# EAGLE design buffer (EAGLE 6.4)

## Sheet 1 of 5
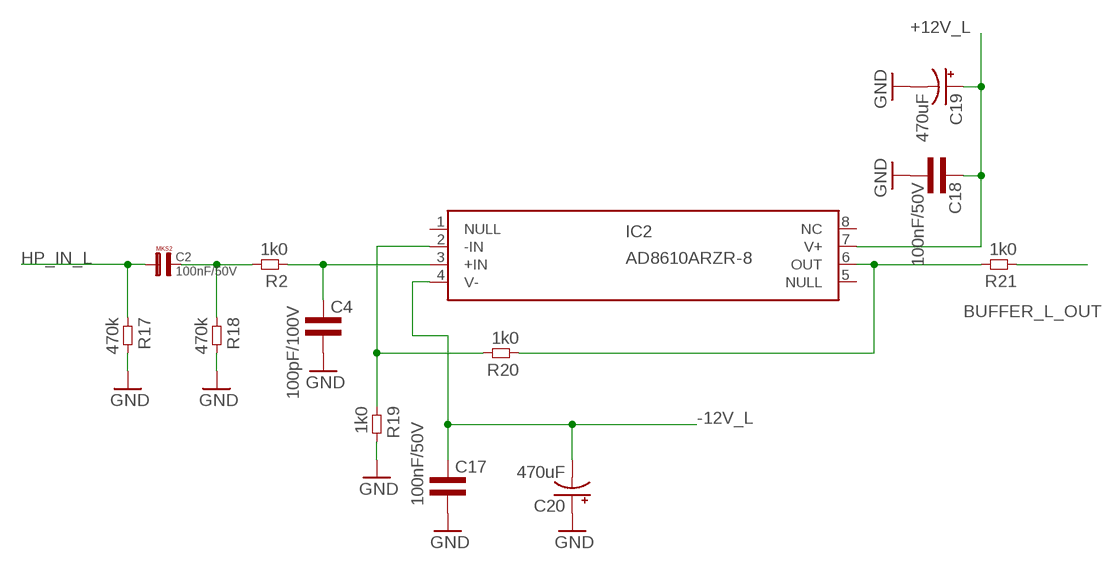
[diagram p0: schematic, sheet 1]

### Parts
C2  100nF/50V  0,1µF  [R5B3]
C4  100pF/100V  CAP0603L3  [0603L3]
C17  100nF/50V  CAP0603L3  [0603L3]
C18  100nF/50V  CAP0603L3  [0603L3]
C19  470uF  CPOL-USE3.5-8  [E3,5-8]
C20  470uF  CPOL-USE3.5-8  [E3,5-8]
IC2  AD8610ARZR-8  [8-LEAD-SOIC_N]
R2  1k0  RES0603L3  [0603L3]
R17  470k  RES0603L3  [0603L3]
R18  470k  RES0603L3  [0603L3]
R19  1k0  RES0603L3  [0603L3]
R20  1k0  RES0603L3  [0603L3]
R21  1k0  RES0603L3  [0603L3]

### Nets
+12V_L: C18.P$1 C19.+ IC2.7(V+) ; also sheet 2
-12V_L: C17.P$1 C20.- IC2.4(V-) ; also sheet 2
BUFF_L_OUT: R21.P$1 ; also sheet 2
BUFFER_L_OUT: IC2.6(OUT) R20.P$1 R21.P$2
GND: C4.P$2 C17.P$2 C18.P$2 C19.- C20.+ R17.P$2 R18.P$2 R19.P$2 ; also sheet 2,3,4,5
HP_IN_L: C2.1 R17.P$1 ; also sheet 5
N$6: C2.2 R2.P$2 R18.P$1
N$7: C4.P$1 IC2.3(+IN) R2.P$1
N$12: IC2.2(-IN) R19.P$1 R20.P$2
Unconnected: IC2.1(NULL) IC2.5(NULL) IC2.8(NC)

## Sheet 2 of 5
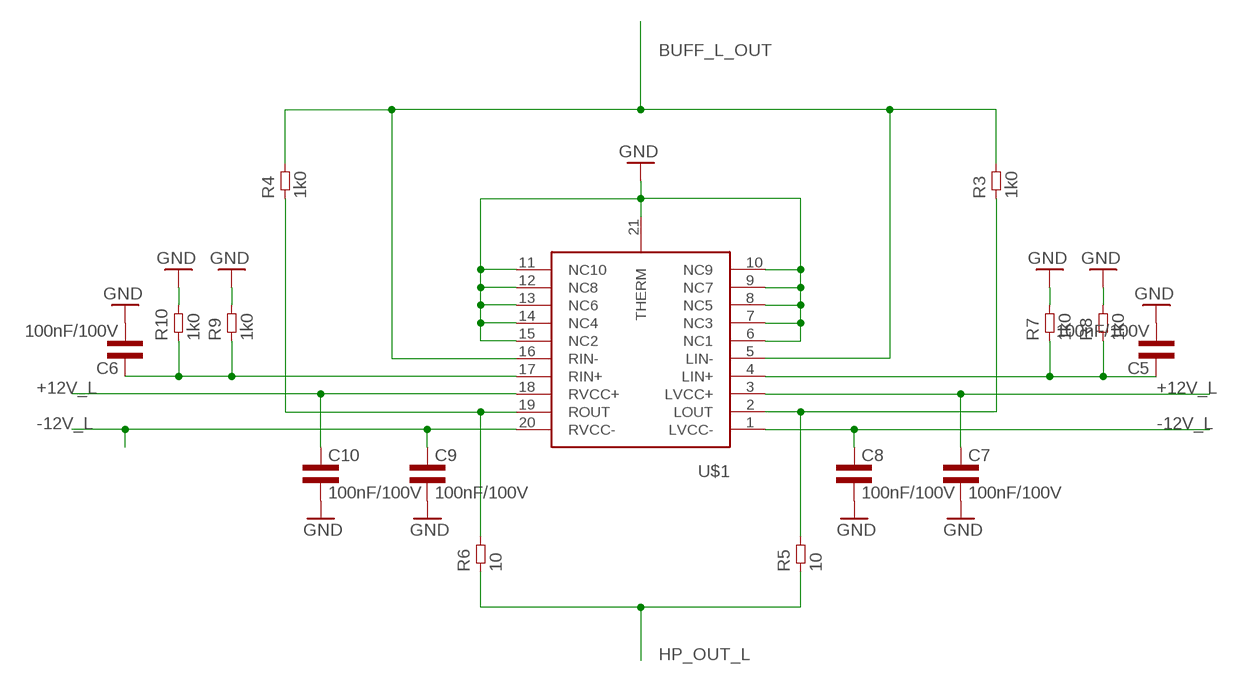
[diagram p1: schematic, sheet 2]

### Parts
C5  100nF/100V  CAP0603L3  [0603L3]
C6  100nF/100V  CAP0603L3  [0603L3]
C7  100nF/100V  CAP0805L3  [0805L3]
C8  100nF/100V  CAP0805L3  [0805L3]
C9  100nF/100V  CAP0805L3  [0805L3]
C10  100nF/100V  CAP0805L3  [0805L3]
R3  1k0  RES0603L3  [0603L3]
R4  1k0  RES0603L3  [0603L3]
R5  10  RES1210L3  [1210L3]
R6  10  RES1210L3  [1210L3]
R7  1k0  RES0603L3  [0603L3]
R8  1k0  RES0603L3  [0603L3]
R9  1k0  RES0603L3  [0603L3]
R10  1k0  RES0603L3  [0603L3]
U$1  TPA6120_TPA6120  [TPA6120_TPA6120]

### Nets
+12V_L: C7.1 C10.1 U$1.3(LVCC+) U$1.18(RVCC+) ; also sheet 1
-12V_L: C8.1 C9.1 U$1.1(LVCC-) U$1.20(RVCC-) ; also sheet 1
BUFF_L_OUT: R3.P$2 R4.P$2 U$1.5(LIN-) U$1.16(RIN-) ; also sheet 1
GND: C5.P$2 C6.P$2 C7.2 C8.2 C9.2 C10.2 R7.P$2 R8.P$2 R9.P$2 R10.P$2 U$1.6(NC1) U$1.7(NC3) U$1.8(NC5) U$1.9(NC7) U$1.10(NC9) U$1.11(NC10) U$1.12(NC8) U$1.13(NC6) U$1.14(NC4) U$1.15(NC2) U$1.21(THERM) ; also sheet 1,3,4,5
HP_OUT_L: R5.P$1 R6.P$1 ; also sheet 5
N$19: C5.P$1 R7.P$1 R8.P$1 U$1.4(LIN+)
N$20: C6.P$1 R9.P$1 R10.P$1 U$1.17(RIN+)
OUT_L: R3.P$1 R5.P$2 U$1.2(LOUT)
OUT_R: R4.P$1 R6.P$2 U$1.19(ROUT)

## Sheet 3 of 5
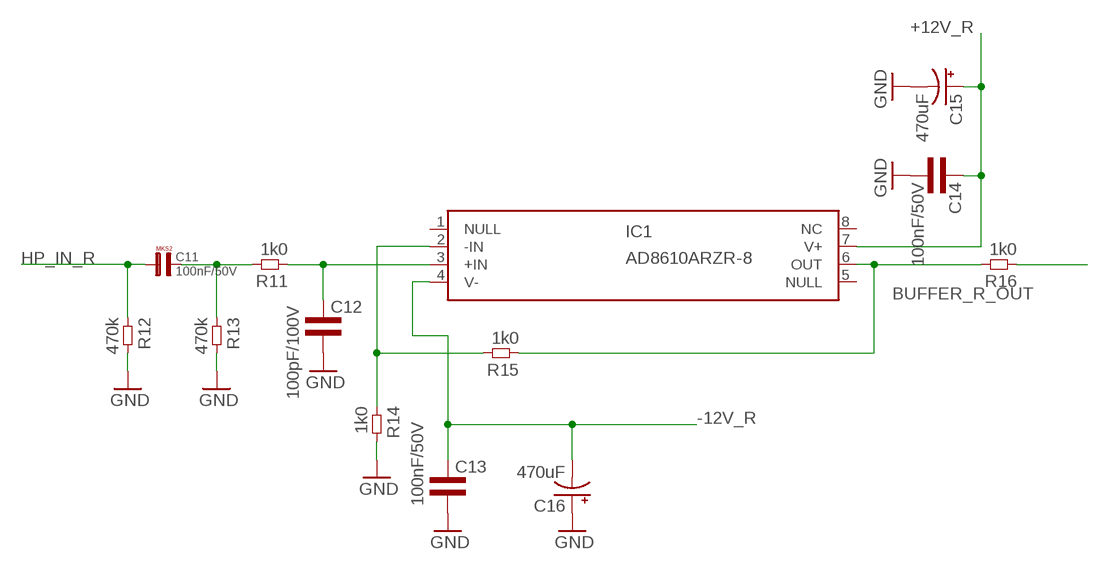
[diagram p2: schematic, sheet 3]

### Parts
C11  100nF/50V  0,1µF  [R5B3]
C12  100pF/100V  CAP0603L3  [0603L3]
C13  100nF/50V  CAP0603L3  [0603L3]
C14  100nF/50V  CAP0603L3  [0603L3]
C15  470uF  CPOL-USE3.5-8  [E3,5-8]
C16  470uF  CPOL-USE3.5-8  [E3,5-8]
IC1  AD8610ARZR-8  [8-LEAD-SOIC_N]
R11  1k0  RES0603L3  [0603L3]
R12  470k  RES0603L3  [0603L3]
R13  470k  RES0603L3  [0603L3]
R14  1k0  RES0603L3  [0603L3]
R15  1k0  RES0603L3  [0603L3]
R16  1k0  RES0603L3  [0603L3]

### Nets
+12V_R: C14.P$1 C15.+ IC1.7(V+) ; also sheet 4
-12V_R: C13.P$1 C16.- IC1.4(V-) ; also sheet 4
BUFF_R_OUT: R16.P$1 ; also sheet 4
BUFFER_R_OUT: IC1.6(OUT) R15.P$1 R16.P$2
GND: C12.P$2 C13.P$2 C14.P$2 C15.- C16.+ R12.P$2 R13.P$2 R14.P$2 ; also sheet 1,2,4,5
HP_IN_R: C11.1 R12.P$1 ; also sheet 5
N$1: C11.2 R11.P$2 R13.P$1
N$2: C12.P$1 IC1.3(+IN) R11.P$1
N$5: IC1.2(-IN) R14.P$1 R15.P$2
Unconnected: IC1.1(NULL) IC1.5(NULL) IC1.8(NC)

## Sheet 4 of 5
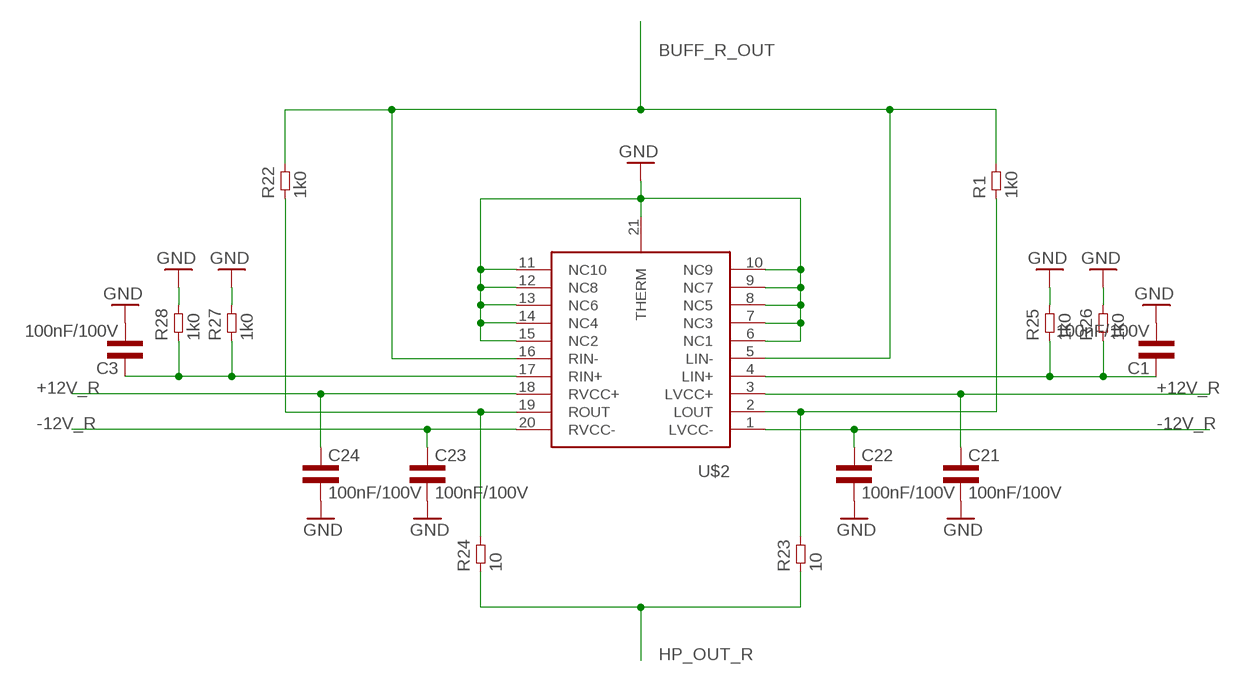
[diagram p3: schematic, sheet 4]

### Parts
C1  100nF/100V  CAP0603L3  [0603L3]
C3  100nF/100V  CAP0603L3  [0603L3]
C21  100nF/100V  CAP0805L3  [0805L3]
C22  100nF/100V  CAP0805L3  [0805L3]
C23  100nF/100V  CAP0805L3  [0805L3]
C24  100nF/100V  CAP0805L3  [0805L3]
R1  1k0  RES0603L3  [0603L3]
R22  1k0  RES0603L3  [0603L3]
R23  10  RES1210L3  [1210L3]
R24  10  RES1210L3  [1210L3]
R25  1k0  RES0603L3  [0603L3]
R26  1k0  RES0603L3  [0603L3]
R27  1k0  RES0603L3  [0603L3]
R28  1k0  RES0603L3  [0603L3]
U$2  TPA6120_TPA6120  [TPA6120_TPA6120]

### Nets
+12V_R: C21.1 C24.1 U$2.3(LVCC+) U$2.18(RVCC+) ; also sheet 3
-12V_R: C22.1 C23.1 U$2.1(LVCC-) U$2.20(RVCC-) ; also sheet 3
BUFF_R_OUT: R1.P$2 R22.P$2 U$2.5(LIN-) U$2.16(RIN-) ; also sheet 3
GND: C1.P$2 C3.P$2 C21.2 C22.2 C23.2 C24.2 R25.P$2 R26.P$2 R27.P$2 R28.P$2 U$2.6(NC1) U$2.7(NC3) U$2.8(NC5) U$2.9(NC7) U$2.10(NC9) U$2.11(NC10) U$2.12(NC8) U$2.13(NC6) U$2.14(NC4) U$2.15(NC2) U$2.21(THERM) ; also sheet 1,2,3,5
HP_OUT_R: R23.P$1 R24.P$1 ; also sheet 5
N$13: C1.P$1 R25.P$1 R26.P$1 U$2.4(LIN+)
N$14: C3.P$1 R27.P$1 R28.P$1 U$2.17(RIN+)
OUT_L1: R1.P$1 R23.P$2 U$2.2(LOUT)
OUT_R1: R22.P$1 R24.P$2 U$2.19(ROUT)

## Sheet 5 of 5
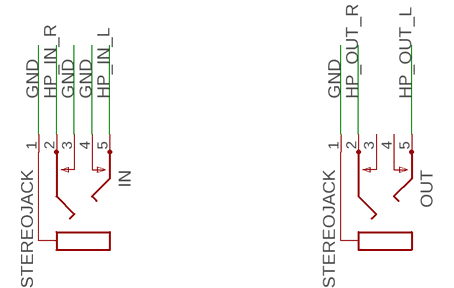
[diagram p4: schematic, sheet 5]

### Parts
IN  STEREOJACK  [STX3100]
OUT  STEREOJACK  [STX3100]

### Nets
GND: IN.1 IN.3 IN.4 OUT.1 ; also sheet 1,2,3,4
HP_IN_L: IN.5 ; also sheet 1
HP_IN_R: IN.2 ; also sheet 3
HP_OUT_L: OUT.5 ; also sheet 2
HP_OUT_R: OUT.2 ; also sheet 4
Unconnected: OUT.3 OUT.4

## Library data of the parts
C1 C3-C10 C12-C14 C17 C18 C21-C24 = common:CAP
C2 C11 = Capacitor-Wima-MKS2-100v:0,1µF
C15 C16 C19 C20 = rcl:CPOL-US: POLARIZED CAPACITOR, American symbol
IC1 IC2 = ad8610arz:AD8610ARZ: edit this description Auto generated by make-symbol-device-package-bsdl.ulp Rev. 43 Source:
IN OUT = adafruit:STEREOJACK: MIC/HEADPHONE JACK Stereo jack with two switches. Kycon STX3100, CUI SJ1-3555NG and/or 4UCon 05544
R1-R28 = common:RES
U$1 U$2 = amp:TPA6120_TPA6120

## Board
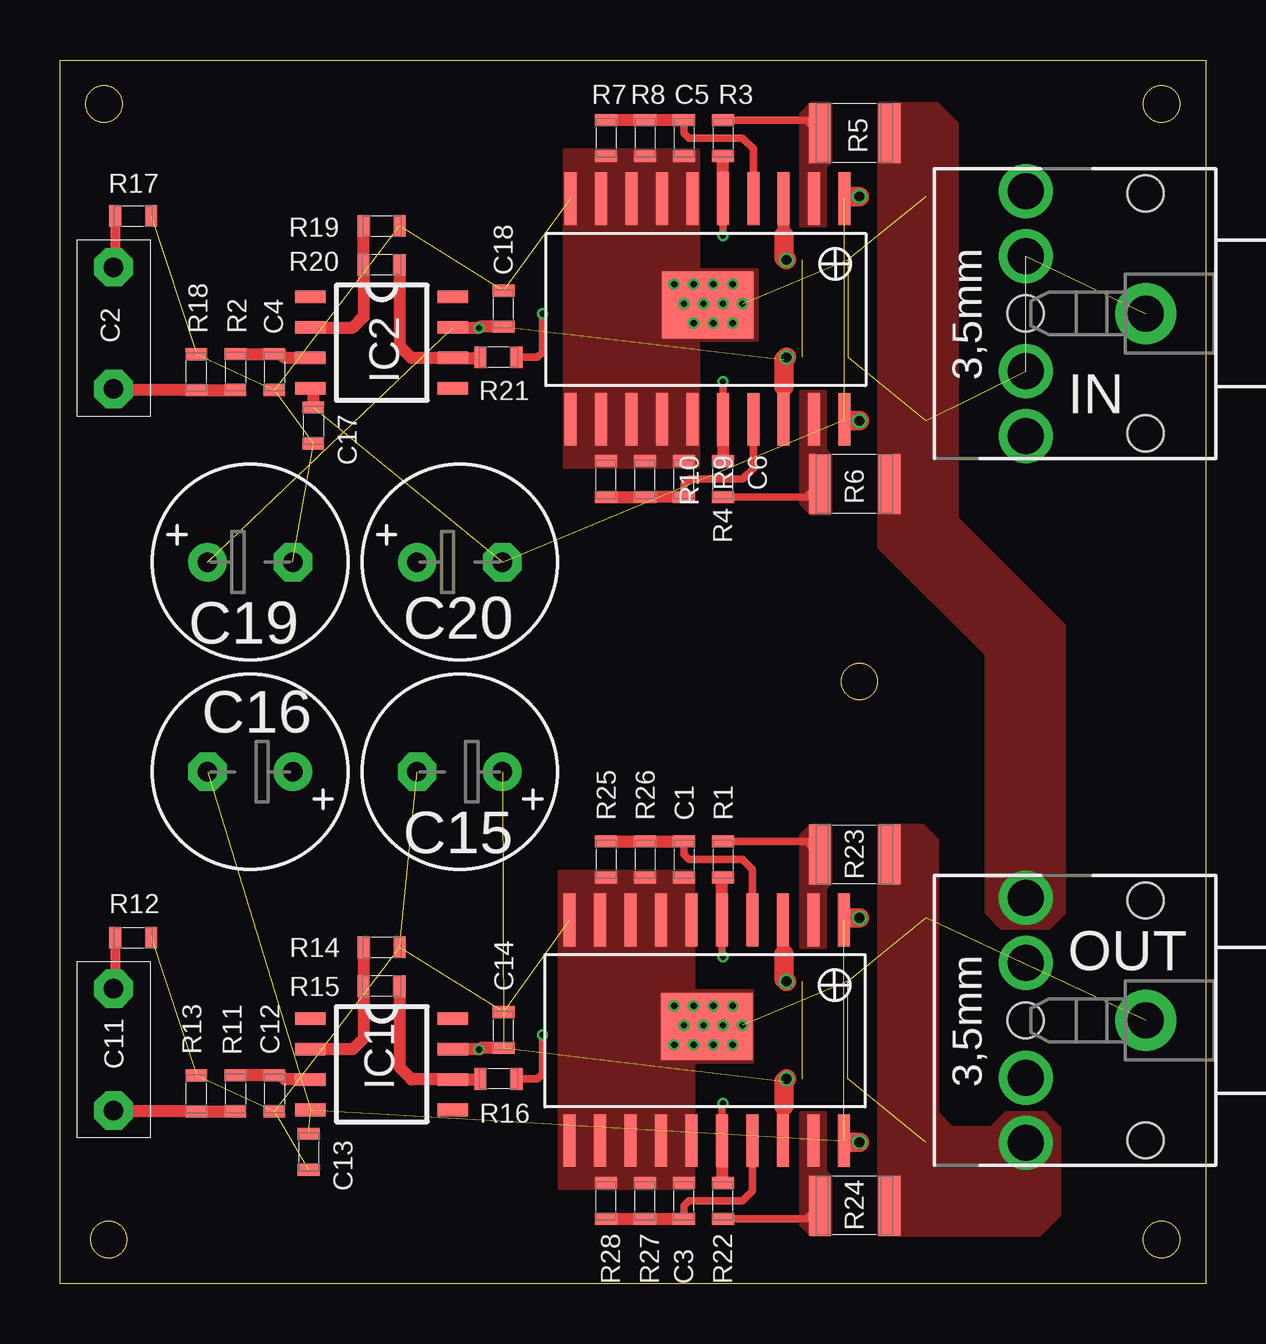
[diagram p5: board, top side]
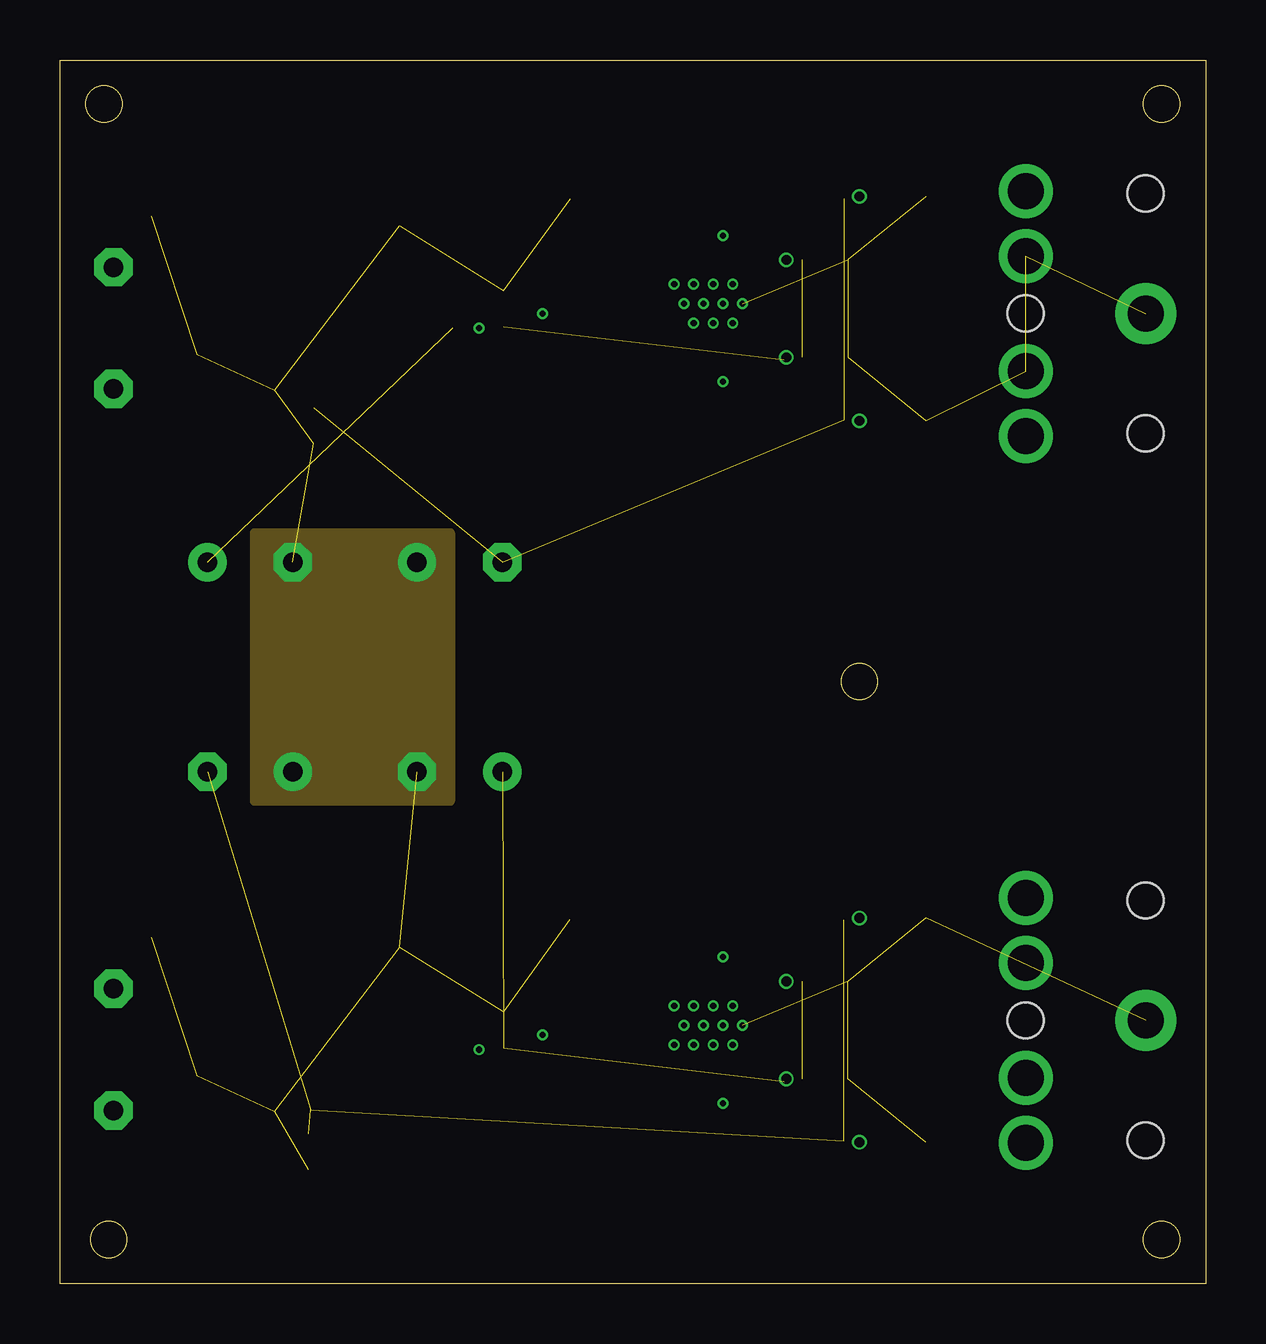
[diagram p6: board, inner layer Route2]
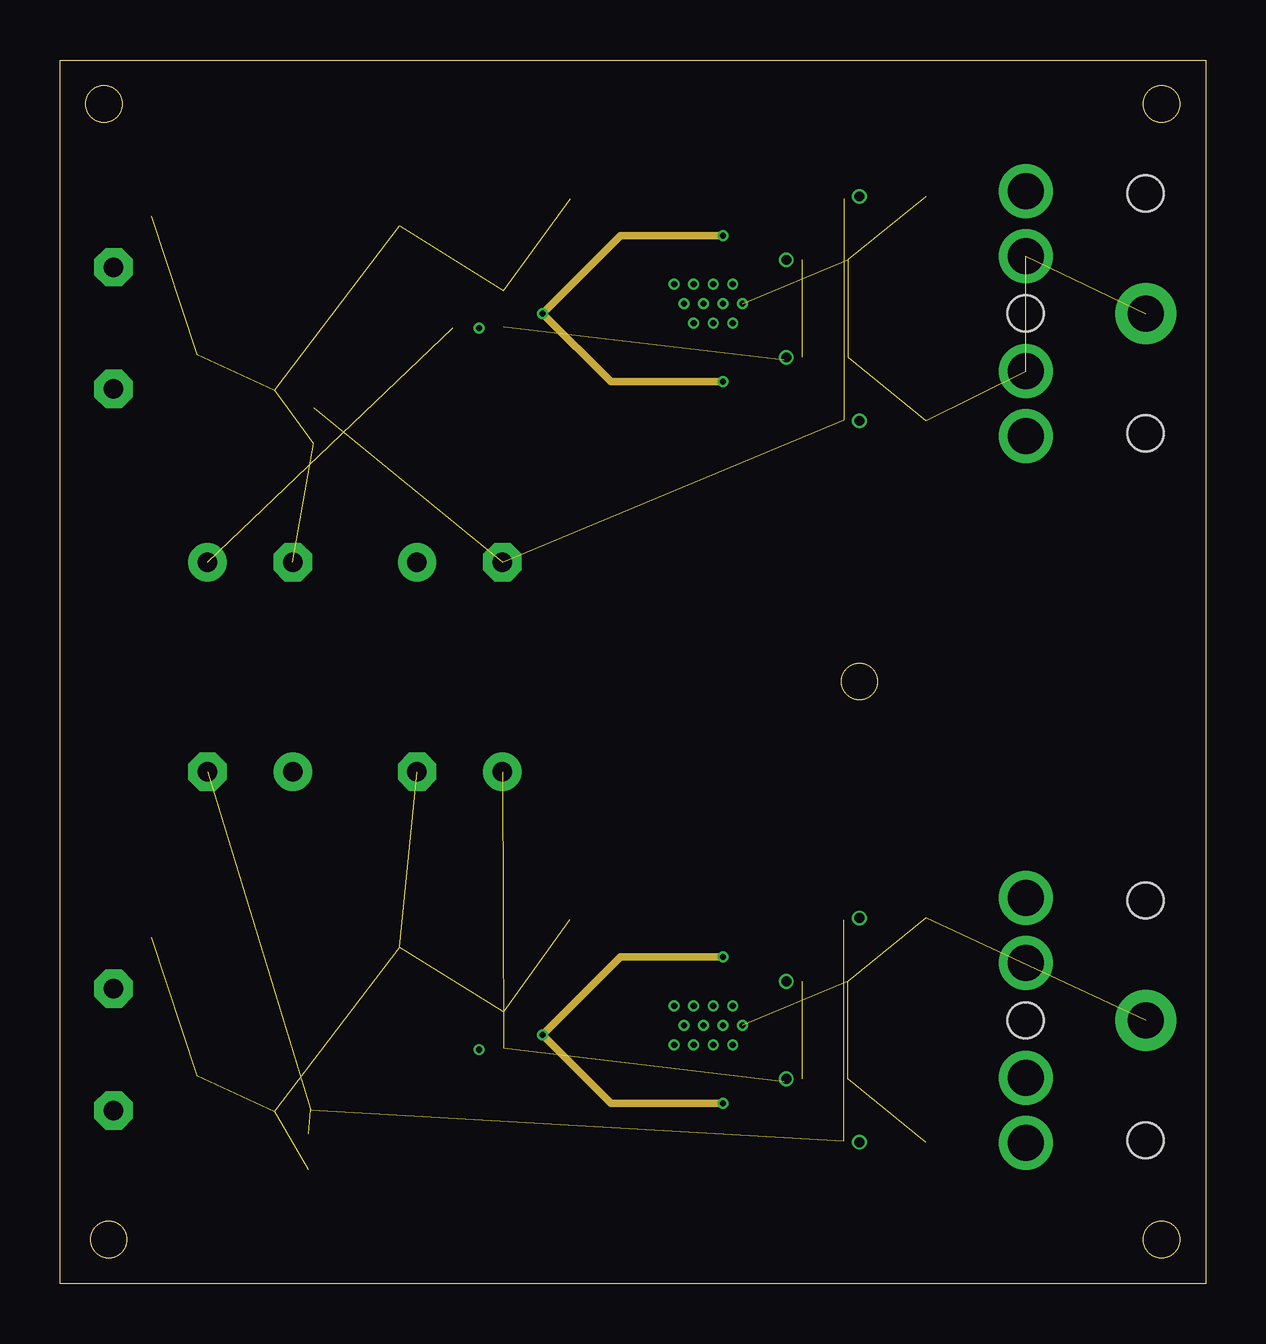
[diagram p7: board, inner layer Route3]
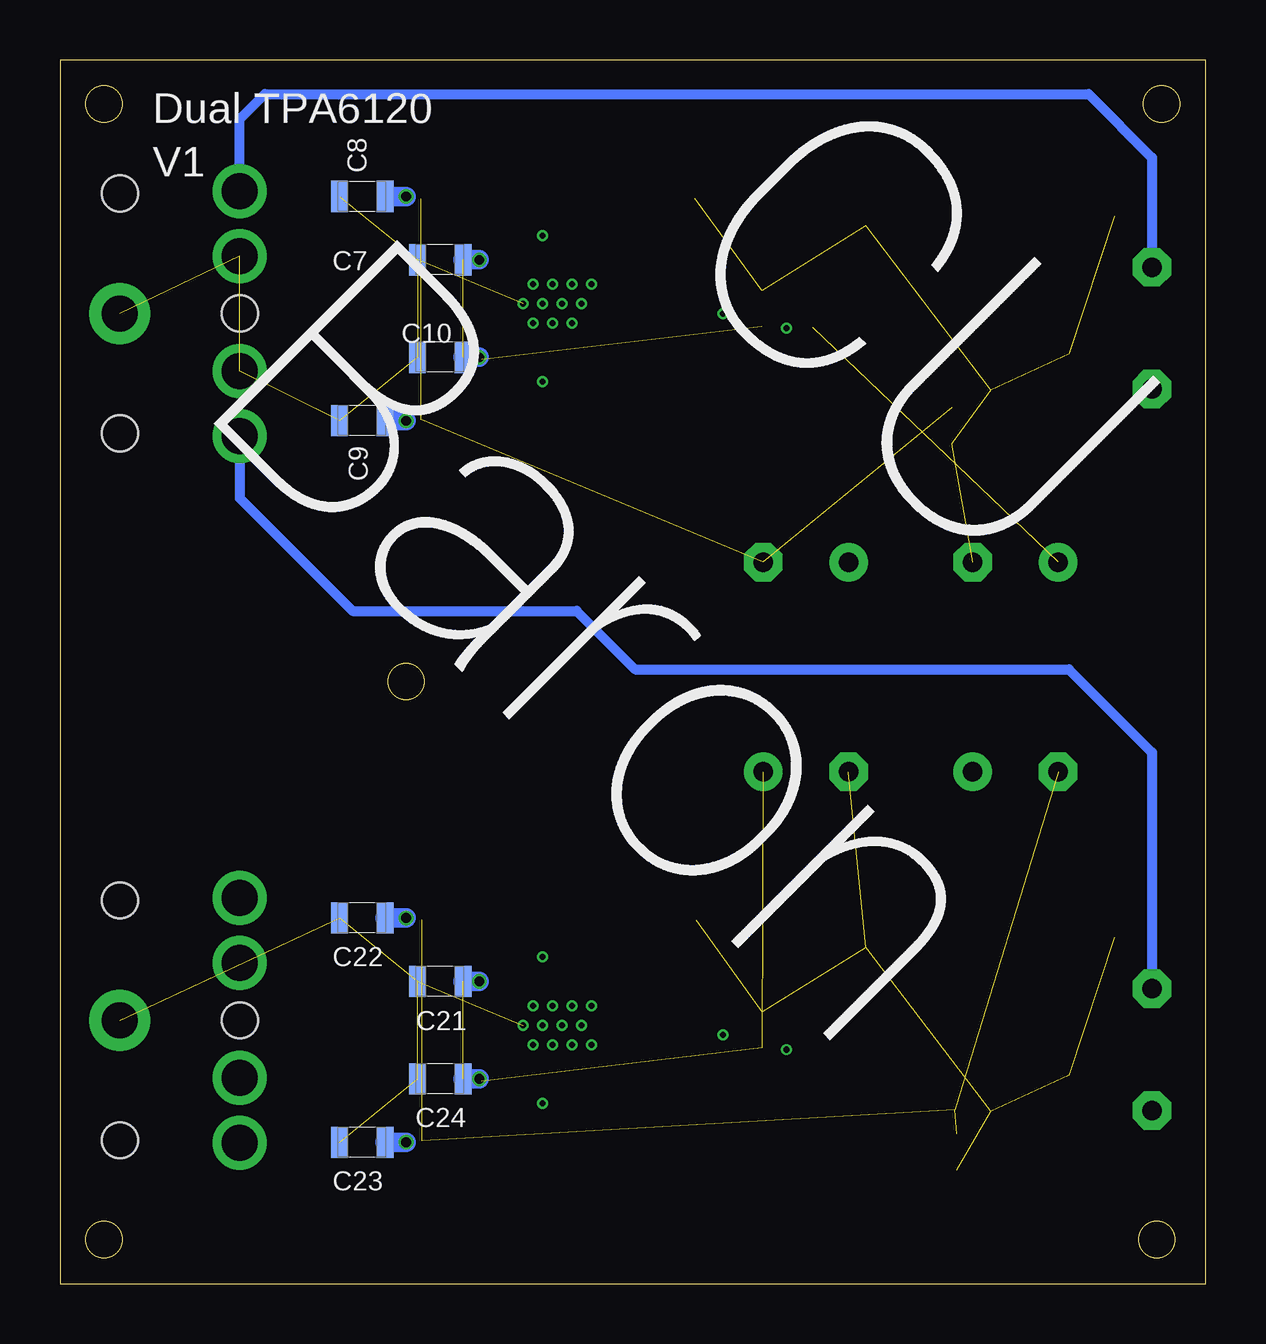
[diagram p8: board, bottom side, seen from below]

Size 47.75 x 51 mm. Coordinates in mm from the lower left corner, seen from the top.
Outline: 0,0 0,51 47.75,51 47.75,0 0,0
Outline: circle at 1.83,49.17 radius 0.76
Outline: circle at 45.92,49.17 radius 0.76
Outline: circle at 2.03,1.83 radius 0.76
Outline: circle at 45.92,1.83 radius 0.76
Outline: circle at 33.32,25.1 radius 0.76
Copper layers (1*2*3*16): Top 0.0356mm / dielectric 1.5011mm / Route2 0.0356mm / dielectric 0.1499mm / Route3 0.0356mm / dielectric 0.2007mm / Bottom 0.0356mm
Design rules "LaenPCBOrder *": minimum track width 5mil, minimum drill 10mil, track to track 5mil, track to pad 5mil, pad to pad 5mil, via to via 5mil, smd to smd 5mil, copper to edge 15mil, drill to drill 6mil, minimum pad ring 4mil, minimum via ring 4mil, stop-mask expansion 3mil, vias tented up to drill 16mil, thermal gap 10mil

### Footprints (pad centres in the part's own frame; a part is rotated, then mirrored left to right if it is on the bottom)
0603L3 = smd 0.5 x 0.9: P$1 -0.75,0; P$2 0.75,0
R5B3 = drill 0.813 pad 1.6 octagon: 1 -2.54,0; 2 2.54,0
0805L3 = smd 0.7 x 1.3: 1 -0.95,0; 2 0.95,0
E3,5-8 = drill 0.813 pad 1.6: + -1.778,0 | drill 0.813 pad 1.6 octagon: - 1.778,0
8-LEAD-SOIC_N = smd 1.27 x 0.53: 1 -2.965,1.905; 2 -2.965,0.635; 3 -2.965,-0.635; 4 -2.965,-1.905; 5 2.965,-1.905; 6 2.965,-0.635; 7 2.965,0.635; 8 2.965,1.905
STX3100 = drill 1.5 pad 2.54: 1 2.7,-0.1 | drill 1.5: 2 7.7,5; 3 7.7,2.3; 4 7.7,-2.5; 5 7.7,-5.2 | hole 1.5: 2.7,4.9; 2.7,-5.1; 7.7,-0.1
1210L3 = smd 0.9 x 2.5: P$1 -1.45,0; P$2 1.45,0
TPA6120_TPA6120 = smd 0.5 x 2.2: 1 0.25,1.095; 2 1.52,1.095; 3 2.79,1.095; 4 4.06,1.095; 5 5.33,1.095; 6 6.6,1.095; 7 7.87,1.095; 8 9.14,1.095; 9 10.41,1.095; 10 11.68,1.095; 11 11.68,10.295; 12 10.41,10.295; 13 9.14,10.295; 14 7.87,10.295; 15 6.6,10.295; 16 5.33,10.295; 17 4.06,10.295; 18 2.79,10.295; 19 1.52,10.295; 20 0.25,10.295 | smd 3.81 x 2.79: 21 5.965,5.54

### Placement (x,y rotation side)
C1  26.01,17.68 270 top
C2  2.24,39.83 270 top
C3  26.01,3.45 90 top
C4  8.94,38 270 top
C5  26.01,47.75 270 top
C6  26.01,33.53 90 top
C7  31.9,42.67 180 bottom
C8  35.15,45.31 180 bottom
C9  35.15,35.97 180 bottom
C10  31.9,38.61 180 bottom
C11  2.24,9.75 270 top
C12  8.94,7.92 270 top
C13  10.36,5.49 270 top
C14  18.49,10.57 90 top
C15  16.66,21.34 180 top
C16  7.92,21.34 180 top
C17  10.57,35.76 270 top
C18  18.49,40.64 90 top
C19  7.92,30.07 0 top
C20  16.66,30.07 0 top
C21  31.9,12.6 180 bottom
C22  35.15,15.24 180 bottom
C23  35.15,5.89 180 bottom
C24  31.9,8.53 180 bottom
IC1  13.41,9.14 0 top
IC2  13.41,39.22 0 top
IN  47.96,40.34 180 top
OUT  47.96,10.87 180 top
R1  27.64,17.68 270 top
R2  7.32,38 270 top
R3  27.64,47.75 270 top
R4  27.64,33.53 90 top
R5  33.12,47.96 180 top
R6  33.12,33.32 180 top
R7  22.76,47.75 270 top
R8  24.38,47.75 270 top
R9  24.38,33.53 90 top
R10  22.76,33.53 90 top
R11  7.32,7.92 270 top
R12  3.05,14.43 0 top
R13  5.69,7.92 90 top
R14  13.41,14.02 0 top
R15  13.41,12.4 180 top
R16  18.29,8.53 180 top
R17  3.05,44.5 0 top
R18  5.69,38 90 top
R19  13.41,44.09 0 top
R20  13.41,42.47 180 top
R21  18.29,38.61 180 top
R22  27.64,3.45 90 top
R23  33.12,17.88 180 top
R24  33.12,3.25 180 top
R25  22.76,17.68 270 top
R26  24.38,17.68 270 top
R27  24.38,3.45 90 top
R28  22.76,3.45 90 top
U$1  32.96,46.32 180 top
U$2  32.92,16.26 180 top

### Tracks (layer width: path | path; a pad name or v marks a point on that pad's centre or on a via)
+12V_L  (via drill 0.25, 0.41)  (3 unrouted)
  Top 0.508: U$1.3 30.17,43.7 30.18,43.69 | U$1.18 30.17,37.38 30.18,37.39 | IC2.7 17.45,39.85 v17.48,39.83 17.54,39.89 C18.P$1
  Top 0.813: 30.18,43.69 30.18,42.77 v30.28,42.67 | 30.18,37.39 30.18,38.51 v30.28,38.61
  Bottom 0.813: C7.1 v30.28,42.67 | C10.1 v30.28,38.61
+12V_R  (via drill 0.25, 0.41)  (3 unrouted)
  Top 0.508: U$2.18 30.13,7.17 30.18,7.42 | U$2.3 30.13,13.97 30.18,13.72 | IC1.7 17.45,9.78 v17.48,9.75 17.54,9.82 C14.P$1
  Top 0.813: 30.18,7.42 30.18,8.43 v30.28,8.53 | 30.18,13.72 30.18,12.7 v30.28,12.6
  Bottom 0.813: C24.1 v30.28,8.53 | C21.1 v30.28,12.6
-12V_L  (via drill 0.41)  (3 unrouted)
  Top 0.508: C17.P$1 10.57,37.19 IC2.4 | U$1.20 32.92,36.02 32.92,35.97 | U$1.1 32.92,45.22 32.92,45.31
  Top 0.813: 32.92,45.31 v33.32,45.31 | 32.92,35.97 v33.32,35.97
  Bottom 0.61: C8.1 33.93,45.31 | C9.1 33.93,35.97
  Bottom 0.813: 33.93,45.31 v33.32,45.31 | 33.93,35.97 v33.32,35.97
-12V_R  (via drill 0.41)  (4 unrouted)
  Top 0.508: U$2.1 32.84,15.16 32.92,15.24 | U$2.20 32.85,5.96 32.92,5.89
  Top 0.813: 32.92,15.24 v33.32,15.24 | 32.92,5.89 v33.32,5.89
  Bottom 0.813: C22.1 v33.32,15.24 | C23.1 v33.32,5.89
BUFF_L_OUT  (via drill 0.25)
  Top 0.305: R21.P$1 19.91,38.61 20.12,38.81 v20.12,40.44 | U$1.16 v27.63,37.58 v27.64,37.59 | U$1.5 v27.63,43.7 v27.64,43.69
  Top 0.508: U$1.5 R3.P$2 | U$1.16 R4.P$2
  Route3 0.305: v27.64,37.59 22.96,37.59 v20.12,40.44 23.37,43.69 v27.64,43.69
BUFF_R_OUT  (via drill 0.25)
  Top 0.305: R16.P$1 19.91,8.53 20.12,8.74 v20.12,10.36 | U$2.5 27.59,13.66 v27.64,13.61 | U$2.16 27.59,7.47 v27.64,7.52
  Top 0.508: U$2.5 27.59,16.88 R1.P$2 | U$2.16 27.59,4.25 R22.P$2
  Route3 0.305: v27.64,13.61 23.37,13.61 v20.12,10.36 22.96,7.52 v27.64,7.52
BUFFER_L_OUT
  Top 0.508: R21.P$2 17.51,38.58 IC2.6 14.66,38.58 14.16,39.08 R20.P$1
BUFFER_R_OUT
  Top 0.508: R15.P$1 14.16,9 14.66,8.51 IC1.6 17.51,8.51 R16.P$2
GND  (via drill 0.25)  (26 unrouted)
  other vias: 25.6,11.58 26.42,11.58 27.23,11.58 28.04,11.58 28.45,10.77 27.64,10.77 26.82,10.77 26.01,10.77 25.6,9.96 26.42,9.96 27.23,9.96 28.04,9.96 25.6,41.66 26.42,41.66 27.23,41.66 28.04,41.66 28.45,40.84 27.64,40.84 26.82,40.84 26.01,40.84 26.42,40.03 27.23,40.03 28.04,40.03
  pour Top (no thermals): 29.06,42.27 26.62,42.27 26.62,47.24 21.03,47.24 21.03,34.04 26.62,34.04 26.62,39.32 29.06,39.32
  pour Top (no thermals): 28.85,12.19 26.42,12.19 26.42,17.17 20.83,17.17 20.83,3.96 26.42,3.96 26.42,9.25 28.85,9.25
  pour Route2 (no thermals): 8.13,31.29 16.26,31.29 16.26,20.12 8.13,20.12
HP_IN_L
  Top 0.406: R17.P$1 2.3,42.43 C2.1
  Bottom 0.406: IN.5 40.26,48.54 39.22,49.58 4.88,49.58 2.24,46.94 C2.1
HP_IN_R
  Top 0.406: R12.P$1 2.3,12.36 C11.1
  Bottom 0.406: IN.2 40.26,32.74 35.56,28.04 26.21,28.04 23.77,25.6 5.69,25.6 2.24,22.15 C11.1
HP_OUT_L
  pour Top (no thermals): 34.14,49.17 34.14,32.11 34.14,30.68 38.61,26.21 38.61,15.44 39.22,14.83 41.25,14.83 41.86,15.44 41.86,27.43 37.39,31.9 37.39,48.36 36.58,49.17
HP_OUT_R
  pour Top (no thermals): 34.14,19.1 34.14,2.03 40.84,2.03 41.66,2.84 41.66,6.5 41.05,7.11 39.42,7.11 38.81,6.5 37.19,6.5 36.58,7.11 36.58,18.49 35.97,19.1
N$1
  Top 0.508: R11.P$2 R13.P$1 2.24,7.17 C11.2
N$2
  Top 0.508: IC1.3 9.37,8.51 9.21,8.67 C12.P$1 R11.P$1
N$5
  Top 0.508: R14.P$1 R15.P$2 12.66,10.22 12.22,9.78 IC1.2
N$6
  Top 0.508: R2.P$2 R18.P$1 2.24,37.25 C2.2
N$7
  Top 0.508: R2.P$1 C4.P$1 9.21,38.75 9.37,38.58 IC2.3
N$12
  Top 0.508: R19.P$1 R20.P$2 12.66,40.3 12.22,39.85 IC2.2
N$13
  Top 0.305: U$2.4 28.86,17.27 28.45,17.68 26.21,17.68 26.01,17.88 C1.P$1
  Top 0.508: R25.P$1 R26.P$1 C1.P$1
N$14
  Top 0.305: U$2.17 28.86,3.86 28.45,3.45 26.21,3.45 26.01,3.25 C3.P$1
  Top 0.508: R28.P$1 R27.P$1 C3.P$1
N$19
  Top 0.305: U$1.4 28.9,47.3 28.45,47.75 26.21,47.75 26.01,47.96 C5.P$1
  Top 0.508: C5.P$1 R8.P$1 R7.P$1
N$20
  Top 0.305: U$1.17 28.9,33.98 28.45,33.53 26.21,33.53 26.01,33.32 C6.P$1
  Top 0.508: R10.P$1 R9.P$1 C6.P$1
OUT_L
  Top 0.305: R3.P$1 31.12,48.5 R5.P$2
  pour Top (no thermals): 30.89,44.09 30.89,48.77 31.29,49.17 32.11,49.17 32.11,46.74 31.9,46.53 31.9,44.09
OUT_L1
  Top 0.305: R1.P$1 31.12,18.43 R23.P$2
  pour Top (no thermals): 30.89,14.02 30.89,18.69 31.29,19.1 32.11,19.1 32.11,16.66 31.9,16.46 31.9,14.02
OUT_R
  Top 0.305: R4.P$1 31.12,32.78 R6.P$2
  pour Top (no thermals): 30.89,37.19 30.89,32.51 31.29,32.11 32.11,32.11 32.11,34.54 31.9,34.75 31.9,37.19
OUT_R1
  Top 0.305: R22.P$1 31.12,2.7 R24.P$2
  pour Top (no thermals): 30.89,7.11 30.89,2.44 31.29,2.03 32.11,2.03 32.11,4.47 31.9,4.67 31.9,7.11

### Text on the board
bPlace: Dual TPA6120 | V1